# EAGLE design Klon_Footswitch (EAGLE 6.4)
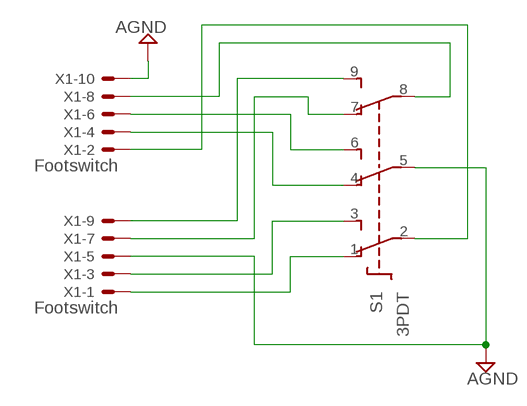
[diagram p0: schematic, sheet 1]

## Parts
S1  3PDT  [3PDT]
X1  Footswitch  87758-1016  [87758-1016]

## Nets
AGND: S1.5(P2) X1.5 X1.10
N$1: S1.1(O1) X1.1
N$2: S1.3(S1) X1.3
N$3: S1.2(P1) X1.2
N$4: S1.4(O2) X1.4
N$5: S1.6(S2) X1.6
N$7: S1.9(S3) X1.9
N$8: S1.7(O3) X1.7
N$9: S1.8(P3) X1.8

## Library data of the parts
S1 = switch:3PDT: 3PDT 9 pin footswitch SF17020F-0302-21R-L Source: 3PDT.jpg
X1 = con-molex:87758-1016: 10 Pin - 2mm Dual Row Single Wafer, Vertical T/H HDR Source: http://www.molex.com/pdm_docs/sd/877580616_sd.pdf; MF: MOLEX; MPN: 87758-1016; OC_FARNELL: 7472340; OC_NEWARK: 59J1558

## Board
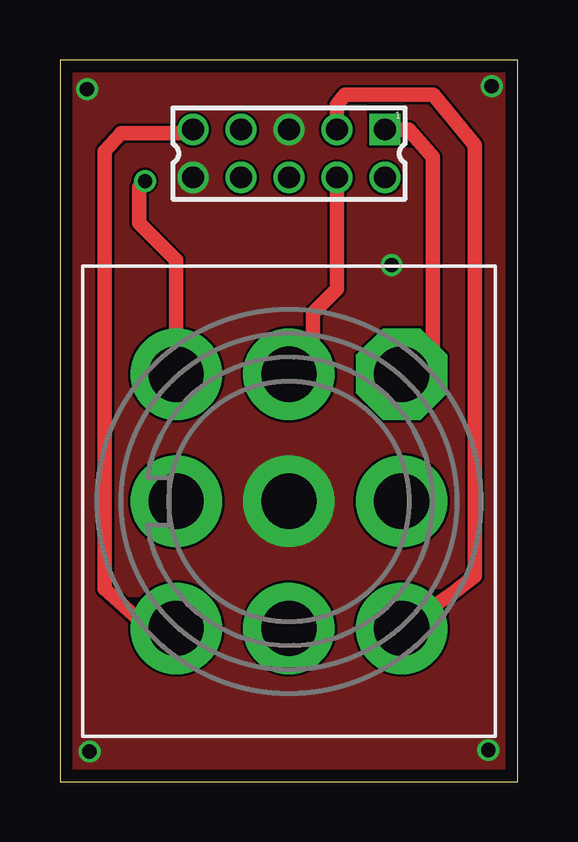
[diagram p1: board, top side]
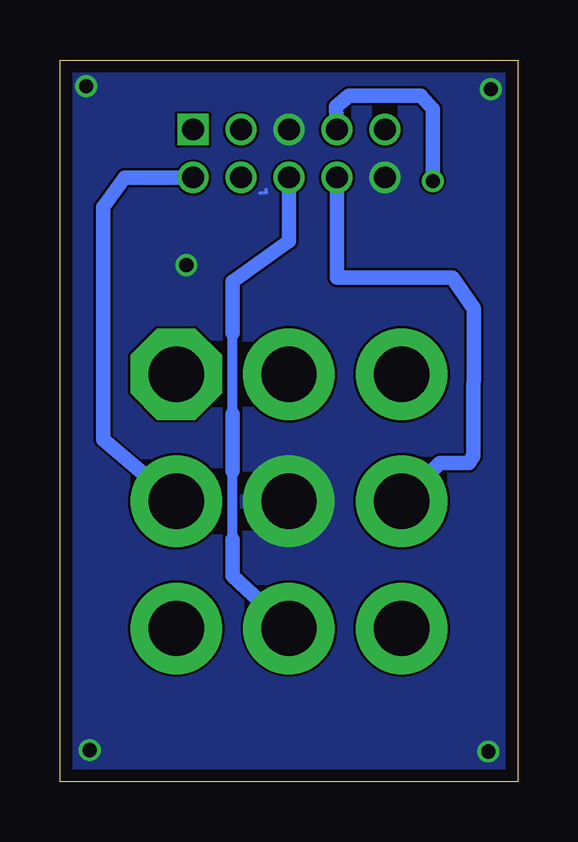
[diagram p2: board, bottom side, seen from below]

Size 19.1 x 30.1 mm. Coordinates in mm from the lower left corner, seen from the top.
Outline: 0,0 19.1,0 19.1,30.1 0,30.1 0,0
Copper layers (1*16): Top 0.035mm / dielectric 1.5mm / Bottom 0.035mm
Design rules "sadek_eagle_designrules_2layer *": minimum track width 0.1mm, minimum drill 0.25mm, track to track 0.1mm, track to pad 0.1mm, pad to pad 0.1mm, via to via 0.1mm, smd to smd 0mil, copper to edge 20mil, drill to drill 8mil, minimum pad ring 8mil, minimum via ring 6mil, stop-mask expansion 3mil, vias tented up to drill 0mil, thermal gap 0mil

### Footprints (pad centres in the part's own frame; a part is rotated, then mirrored left to right if it is on the bottom)
3PDT = drill 2.3 pad 3.81 octagon: 1 -5.3,4.7 | drill 2.3 pad 3.81: 2 0,4.7; 3 5.3,4.7; 4 -5.3,0; 5 0,0; 6 5.3,0; 7 -5.3,-4.7; 8 0,-4.7; 9 5.3,-4.7
87758-1016 = drill 0.9 pad 1.27 square: 1 -4,-1 | drill 0.9 pad 1.27: 2 -4,1; 3 -2,-1; 4 -2,1; 5 0,-1; 6 0,1; 7 2,-1; 8 2,1; 9 4,-1; 10 4,1

### Placement (x,y rotation side)
S1  9.55,11.7 270 top
X1  9.55,26.2 180 top

### Tracks (layer width: path | path; a pad name or v marks a point on that pad's centre or on a via)
AGND  (via drill 0.6)
  Bottom 0.152: 10.5,24.7 10.49,24.57 10.75,24.55
  other vias: 1.24,1.27 17.86,1.33 13.83,21.55 18.01,29.01 1.13,28.88
  pour Top: 19.1,30.1 19.1,0 0,0 0,30.1
  pour Bottom: 0,30.1 19.1,30.1 19.1,0 0,0
N$1
  Top 0.152: S1.1 14.55,17.05
  Top 0.61: X1.1 14.55,27.2 15.55,26.05 15.55,18.05 14.55,17.05
N$2
  Top 0.61: X1.3 11.55,28.24 11.89,28.64 15.58,28.64 17.3,26.55 17.3,8.58 16.52,7.99 S1.3
N$3
  Bottom 0.61: X1.2 16.4,25.2 17.3,23.96 17.3,14.28 S1.2
N$4
  Top 0.61: X1.4 11.55,20.55 10.55,19.55 10.55,18 S1.4
N$5
  Bottom 0.406: 11.89,10.11 11.89,12.96 | 11.89,15.33 11.89,18.71
  Bottom 0.61: S1.6 11.89,8.59 11.89,10.11 | 11.89,12.96 11.89,15.33 | 11.89,18.71 11.89,20.86 9.55,22.55 X1.6
N$7
  Top 0.61: S1.9 3.7,6.4 1.86,8.05 1.86,26.3 2.55,27.05 5.4,27.05 X1.9
N$8  (via drill 0.6)
  Top 0.61: S1.7 4.85,21.75 3.3,23.3 3.3,24.8 v3.55,25.05
  Bottom 0.61: v3.55,25.05 3.55,28.05 4.05,28.61 7.05,28.61 7.58,28.14 X1.7
N$9
  Bottom 0.61: X1.8 7.55,21.02 2.74,21.02 1.83,19.74 1.86,13.58 2.05,13.3 3.25,13.3 S1.8